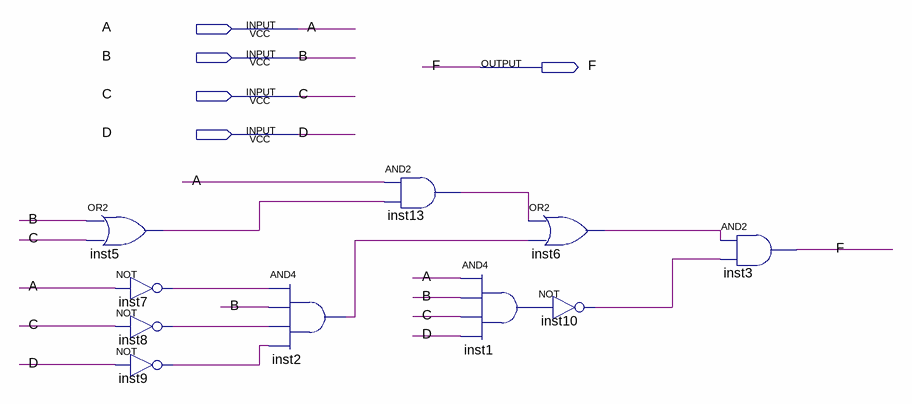
[diagram p0: schematic sheet]
// Quartus schematic prime.bdf as structural Verilog: 10 symbols, 5 pins
module prime (
  input  A,
  input  B,
  input  C,
  input  D,
  output F
);

  wire inst1_out, inst2_out, inst5_out, inst6_out, inst7_out, inst8_out, inst9_out, inst10_out, inst13_out;

  or inst5 (inst5_out, B, C);
  not inst7 (inst7_out, A);
  not inst8 (inst8_out, C);
  not inst9 (inst9_out, D);
  and inst2 (inst2_out, inst7_out, B, inst8_out, inst9_out);
  and inst13 (inst13_out, A, inst5_out);
  and inst1 (inst1_out, A, B, C, D);
  or inst6 (inst6_out, inst13_out, inst2_out);
  not inst10 (inst10_out, inst1_out);
  and inst3 (F, inst6_out, inst10_out);
endmodule
